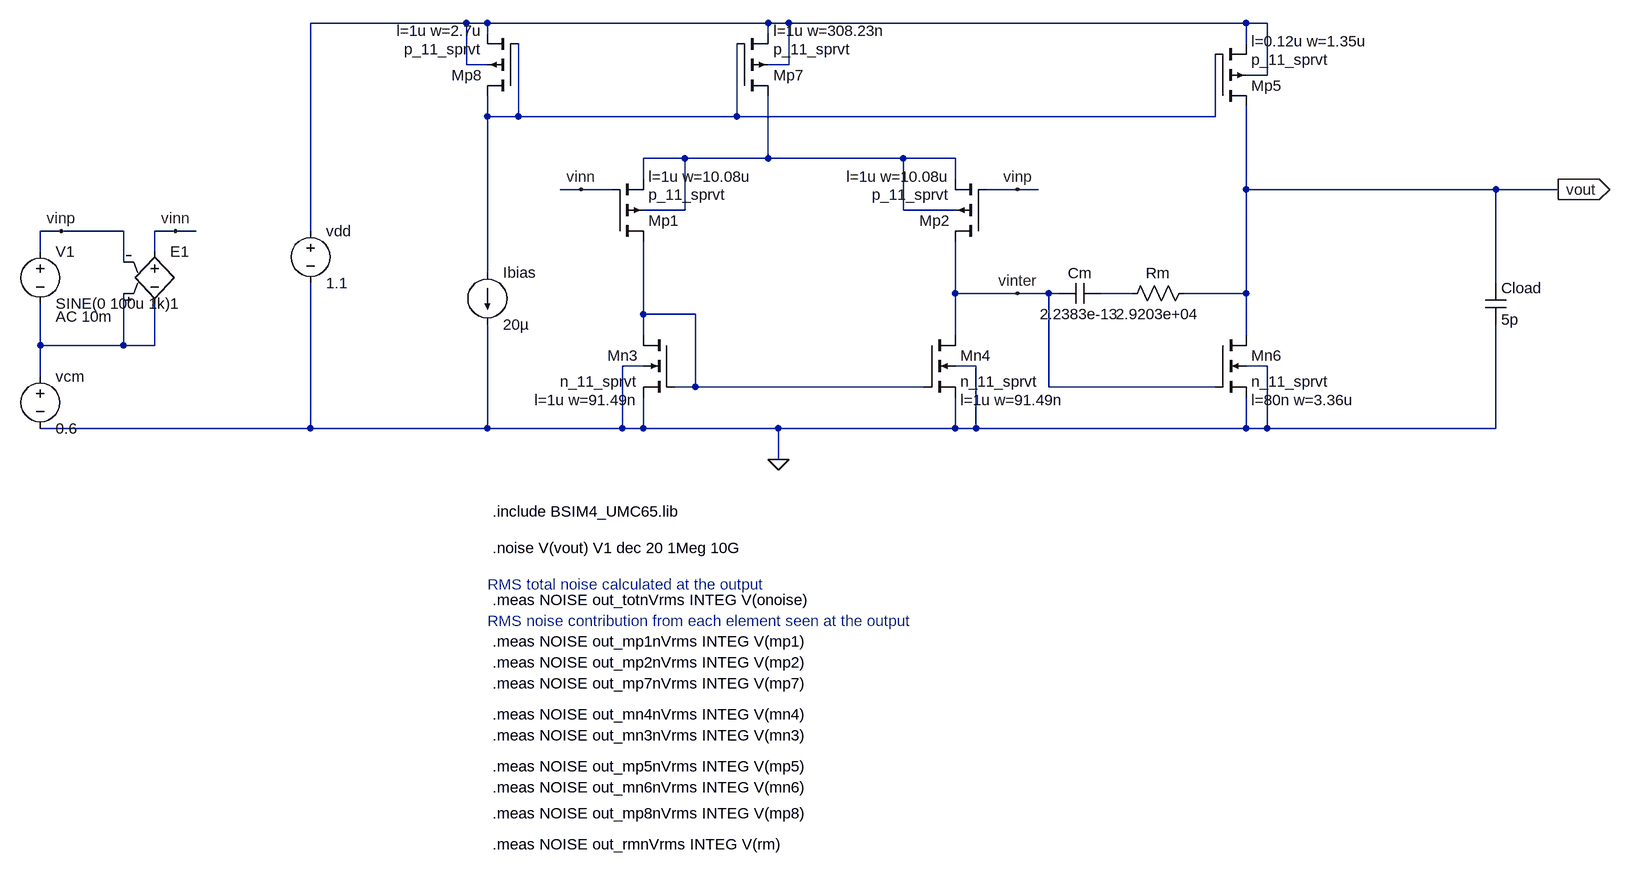
[diagram p0: schematic final_project_noise.asc]
final_project_noise.asc, the LTspice schematic file:
Version 4
SHEET 1 4000 1888
WIRE 2208 528 1968 528
WIRE 2240 528 2208 528
WIRE 2672 528 2240 528
WIRE 2704 528 2672 528
WIRE 3408 528 2704 528
WIRE 3440 528 3408 528
WIRE 2240 544 2240 528
WIRE 2672 544 2672 528
WIRE 3408 560 3408 528
WIRE 2208 592 2208 528
WIRE 2240 592 2208 592
WIRE 2704 592 2704 528
WIRE 2704 592 2672 592
WIRE 3440 608 3440 528
WIRE 3440 608 3408 608
WIRE 2240 672 2240 640
WIRE 2288 672 2288 560
WIRE 2288 672 2240 672
WIRE 2624 672 2624 560
WIRE 2624 672 2288 672
WIRE 3360 672 3360 576
WIRE 3360 672 2624 672
WIRE 2544 736 2480 736
WIRE 2672 736 2672 640
WIRE 2672 736 2544 736
WIRE 2880 736 2672 736
WIRE 2960 736 2880 736
WIRE 2480 768 2480 736
WIRE 2960 768 2960 736
WIRE 2384 784 2352 784
WIRE 2432 784 2384 784
WIRE 3056 784 3008 784
WIRE 3088 784 3056 784
WIRE 3408 784 3408 656
WIRE 3792 784 3408 784
WIRE 3888 784 3792 784
WIRE 2544 816 2544 736
WIRE 2544 816 2480 816
WIRE 2880 816 2880 736
WIRE 2960 816 2880 816
WIRE 1584 848 1552 848
WIRE 1680 848 1584 848
WIRE 1760 848 1728 848
WIRE 1792 848 1760 848
WIRE 1968 848 1968 528
WIRE 1552 880 1552 848
WIRE 1728 880 1728 848
WIRE 1680 896 1680 848
WIRE 2240 912 2240 672
WIRE 3792 928 3792 784
WIRE 2960 944 2960 864
WIRE 3056 944 2960 944
WIRE 3104 944 3056 944
WIRE 3120 944 3104 944
WIRE 3232 944 3184 944
WIRE 3408 944 3408 784
WIRE 3408 944 3312 944
WIRE 2480 976 2480 864
WIRE 2560 976 2480 976
WIRE 2480 1008 2480 976
WIRE 2960 1008 2960 944
WIRE 3408 1008 3408 944
WIRE 1552 1024 1552 960
WIRE 1680 1024 1680 944
WIRE 1680 1024 1552 1024
WIRE 1728 1024 1728 960
WIRE 1728 1024 1680 1024
WIRE 2480 1056 2448 1056
WIRE 2992 1056 2960 1056
WIRE 3440 1056 3408 1056
WIRE 1552 1072 1552 1024
WIRE 2560 1088 2560 976
WIRE 2560 1088 2528 1088
WIRE 2912 1088 2560 1088
WIRE 3104 1088 3104 944
WIRE 3360 1088 3104 1088
WIRE 1968 1152 1968 928
WIRE 1968 1152 1552 1152
WIRE 2240 1152 2240 992
WIRE 2240 1152 1968 1152
WIRE 2448 1152 2448 1056
WIRE 2448 1152 2240 1152
WIRE 2480 1152 2480 1104
WIRE 2480 1152 2448 1152
WIRE 2688 1152 2480 1152
WIRE 2960 1152 2960 1104
WIRE 2960 1152 2688 1152
WIRE 2992 1152 2992 1056
WIRE 2992 1152 2960 1152
WIRE 3408 1152 3408 1104
WIRE 3408 1152 2992 1152
WIRE 3440 1152 3440 1056
WIRE 3440 1152 3408 1152
WIRE 3792 1152 3792 992
WIRE 3792 1152 3440 1152
WIRE 2688 1200 2688 1152
FLAG 3888 784 vout
IOPIN 3888 784 Out
FLAG 1584 848 vinp
FLAG 1760 848 vinn
FLAG 2688 1200 0
FLAG 3056 784 vinp
FLAG 2384 784 vinn
FLAG 3056 944 vinter
SYMBOL voltage 1968 832 R0
WINDOW 123 0 0 Left 0
WINDOW 39 0 0 Left 0
SYMATTR InstName vdd
SYMATTR Value 1.1
SYMBOL voltage 1552 1056 R0
WINDOW 123 24 124 Left 2
WINDOW 39 0 0 Left 0
SYMATTR InstName vcm
SYMATTR Value 0.6
SYMBOL e2 1728 864 R0
SYMATTR InstName E1
SYMATTR Value 1
SYMBOL voltage 1552 864 R0
WINDOW 123 24 116 Left 2
WINDOW 39 0 0 Left 0
SYMATTR Value2 AC 10m
SYMATTR InstName V1
SYMATTR Value SINE(0 100u 1k)
SYMBOL pmos4 2288 640 R180
WINDOW 123 56 100 Left 2
<<<<<<< HEAD
SYMATTR Value2 l=1000n w=2.7u
=======
SYMATTR Value2 l=1u w=2.7u
>>>>>>> refs/remotes/origin/main
SYMATTR InstName Mp8
SYMATTR Value p_11_sprvt
SYMBOL pmos4 2624 640 M180
WINDOW 123 56 100 Left 2
<<<<<<< HEAD
SYMATTR Value2 l=1000n w=308.23n
=======
SYMATTR Value2 l=1u w=308.23n
>>>>>>> refs/remotes/origin/main
SYMATTR InstName Mp7
SYMATTR Value p_11_sprvt
SYMBOL pmos4 2432 864 M180
WINDOW 123 56 100 Left 2
SYMATTR Value2 l=1u w=10.08u
SYMATTR InstName Mp1
SYMATTR Value p_11_sprvt
SYMBOL pmos4 3008 864 R180
WINDOW 123 56 100 Left 2
SYMATTR Value2 l=1u w=10.08u
SYMATTR InstName Mp2
SYMATTR Value p_11_sprvt
SYMBOL nmos4 2912 1008 R0
WINDOW 123 56 100 Left 2
SYMATTR Value2 l=1u w=91.49n
SYMATTR InstName Mn4
SYMATTR Value n_11_sprvt
SYMBOL nmos4 2528 1008 M0
WINDOW 123 56 100 Left 2
SYMATTR Value2 l=1u w=91.49n
SYMATTR InstName Mn3
SYMATTR Value n_11_sprvt
SYMBOL nmos4 3360 1008 R0
WINDOW 123 56 100 Left 2
SYMATTR Value2 l=80n w=3.36u
SYMATTR InstName Mn6
SYMATTR Value n_11_sprvt
SYMBOL pmos4 3360 656 M180
WINDOW 123 56 100 Left 2
<<<<<<< HEAD
SYMATTR Value2 l=120n w=1.35u
=======
SYMATTR Value2 l=0.12u w=1.35u
>>>>>>> refs/remotes/origin/main
SYMATTR InstName Mp5
SYMATTR Value p_11_sprvt
SYMBOL res 3328 928 R90
WINDOW 0 0 56 VBottom 2
WINDOW 3 32 56 VTop 2
SYMATTR InstName Rm
<<<<<<< HEAD
SYMATTR Value 35k
=======
SYMATTR Value 2.9203e+04
>>>>>>> refs/remotes/origin/main
SYMBOL cap 3184 928 R90
WINDOW 0 0 32 VBottom 2
WINDOW 3 32 32 VTop 2
SYMATTR InstName Cm
<<<<<<< HEAD
SYMATTR Value 2.5e-13
=======
SYMATTR Value 2.2383e-13
>>>>>>> refs/remotes/origin/main
SYMBOL current 2240 912 R0
WINDOW 123 0 0 Left 0
WINDOW 39 0 0 Left 0
SYMATTR InstName Ibias
SYMATTR Value 20µ
SYMBOL cap 3776 928 R0
SYMATTR InstName Cload
SYMATTR Value 5p
TEXT 2248 1280 Left 2 !.include BSIM4_UMC65.lib
TEXT 2248 1336 Left 2 !.noise V(vout) V1 dec 20 1Meg 10G
TEXT 2248 1416 Left 2 !.meas NOISE out_totnVrms INTEG V(onoise)
TEXT 2248 1480 Left 2 !.meas NOISE out_mp1nVrms INTEG V(mp1)
TEXT 2248 1512 Left 2 !.meas NOISE out_mp2nVrms INTEG V(mp2)
TEXT 2248 1544 Left 2 !.meas NOISE out_mp7nVrms INTEG V(mp7)
TEXT 2248 1744 Left 2 !.meas NOISE out_mp8nVrms INTEG V(mp8)
TEXT 2248 1672 Left 2 !.meas NOISE out_mp5nVrms INTEG V(mp5)
TEXT 2248 1704 Left 2 !.meas NOISE out_mn6nVrms INTEG V(mn6)
TEXT 2248 1592 Left 2 !.meas NOISE out_mn4nVrms INTEG V(mn4)
TEXT 2248 1624 Left 2 !.meas NOISE out_mn3nVrms INTEG V(mn3)
TEXT 2248 1792 Left 2 !.meas NOISE out_rmnVrms INTEG V(rm)
TEXT 2240 1392 Left 2 ;RMS total noise calculated at the output
TEXT 2240 1448 Left 2 ;RMS noise contribution from each element seen at the output

The netlist it stands for:
* final_project_noise.asc
vdd N001 0 1.1
vcm N006 0 0.6
E1 vinn N006 N006 vinp 1
V1 vinp N006 SINE(0 100u 1k) AC 10m
Mp8 N002 N002 N001 N001 p_11_sprvt l=1u w=2.7u
Mp7 N003 N002 N001 N001 p_11_sprvt l=1u w=308.23n
Mp1 N005 vinn N003 N003 p_11_sprvt l=1u w=10.08u
Mp2 vinter vinp N003 N003 p_11_sprvt l=1u w=10.08u
Mn4 vinter N005 0 0 n_11_sprvt l=1u w=91.49n
Mn3 N005 N005 0 0 n_11_sprvt l=1u w=91.49n
Mn6 vout vinter 0 0 n_11_sprvt l=80n w=3.36u
Mp5 vout N002 N001 N001 p_11_sprvt l=0.12u w=1.35u
Rm vout N004 2.9203e+04
Cm N004 vinter 2.2383e-13
Ibias N002 0 20µ
Cload vout 0 5p
.model NMOS NMOS
.model PMOS PMOS
.lib standard.mos
.include BSIM4_UMC65.lib
.noise V(vout) V1 dec 20 1Meg 10G
.meas NOISE out_totnVrms INTEG V(onoise)
.meas NOISE out_mp1nVrms INTEG V(mp1)
.meas NOISE out_mp2nVrms INTEG V(mp2)
.meas NOISE out_mp7nVrms INTEG V(mp7)
.meas NOISE out_mp8nVrms INTEG V(mp8)
.meas NOISE out_mp5nVrms INTEG V(mp5)
.meas NOISE out_mn6nVrms INTEG V(mn6)
.meas NOISE out_mn4nVrms INTEG V(mn4)
.meas NOISE out_mn3nVrms INTEG V(mn3)
.meas NOISE out_rmnVrms INTEG V(rm)
* RMS total noise calculated at the output
* RMS noise contribution from each element seen at the output
.backanno
.end